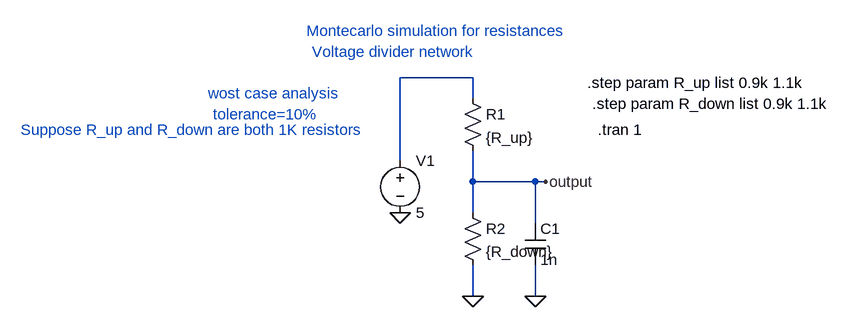
[diagram p0: schematic Montecarlo simulation.asc]
Montecarlo simulation.asc, the LTspice schematic file:
Version 4.1
SHEET 1 880 680
WIRE 176 16 64 16
WIRE 176 48 176 16
WIRE 64 144 64 16
WIRE 176 176 176 128
WIRE 272 176 176 176
WIRE 288 176 272 176
WIRE 176 224 176 176
WIRE 272 240 272 176
WIRE 176 352 176 304
WIRE 272 352 272 304
FLAG 64 224 0
FLAG 176 352 0
FLAG 288 176 output
FLAG 272 352 0
SYMBOL res 160 32 R0
SYMATTR InstName R1
SYMATTR Value {R_up}
SYMBOL res 160 208 R0
SYMATTR InstName R2
SYMATTR Value {R_down}
SYMBOL voltage 64 128 R0
WINDOW 123 0 0 Left 0
WINDOW 39 0 0 Left 0
SYMATTR InstName V1
SYMATTR Value 5
SYMBOL cap 256 240 R0
SYMATTR InstName C1
SYMATTR Value 1n
TEXT -80 -56 Left 2 ;Montecarlo simulation for resistances
TEXT -72 -24 Left 2 ;Voltage divider network
TEXT -232 40 Left 2 ;wost case analysis
TEXT -224 72 Left 2 ;tolerance=10%
TEXT 352 24 Left 2 !.step param R_up list 0.9k 1.1k
TEXT 360 56 Left 2 !.step param R_down list 0.9k 1.1k
TEXT -520 96 Left 2 ;Suppose R_up and R_down are both 1K resistors
TEXT 368 96 Left 2 !.tran 1

The netlist it stands for:
* Montecarlo simulation.asc
R1 N001 output {R_up}
R2 output 0 {R_down}
V1 N001 0 5
C1 output 0 1n
* Montecarlo simulation for resistances
* Voltage divider network
* wost case analysis
* tolerance=10%
.step param R_up list 0.9k 1.1k
.step param R_down list 0.9k 1.1k
* Suppose R_up and R_down are both 1K resistors
.tran 1
.backanno
.end